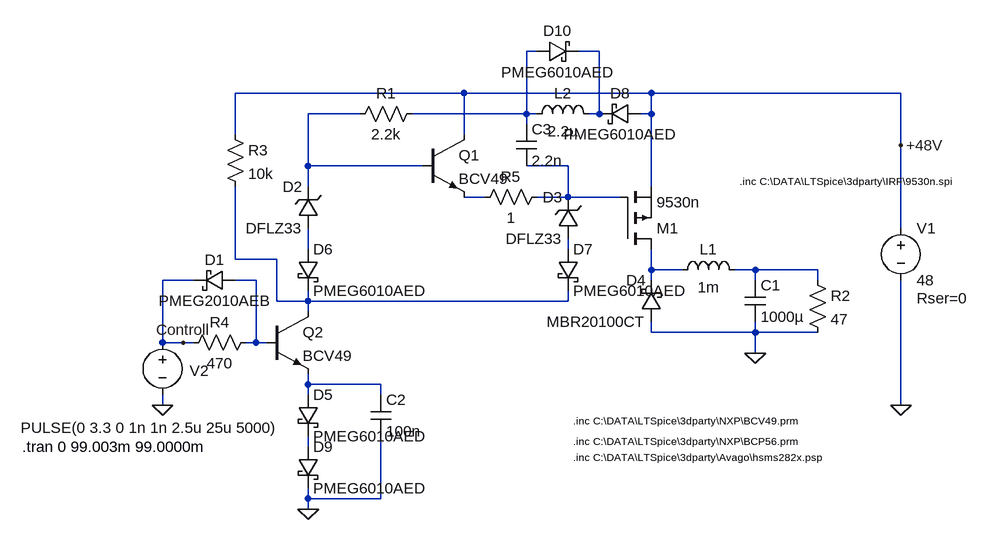
[diagram p0: schematic driver4.asc]
driver4.asc, the LTspice schematic file:
Version 4
SHEET 1 908 680
WIRE 208 -144 192 -144
WIRE 304 -144 272 -144
WIRE 96 -80 -256 -80
WIRE 384 -80 96 -80
WIRE 768 -80 384 -80
WIRE -64 -48 -144 -48
WIRE 192 -48 192 -144
WIRE 192 -48 16 -48
WIRE 208 -48 192 -48
WIRE 304 -48 304 -144
WIRE 304 -48 288 -48
WIRE 384 -48 384 -80
WIRE 384 -48 368 -48
WIRE 192 -32 192 -48
WIRE -256 -16 -256 -80
WIRE 96 -16 96 -80
WIRE 768 0 768 -80
WIRE -144 32 -144 -48
WIRE 32 32 -144 32
WIRE 256 32 192 32
WIRE -144 64 -144 32
WIRE 384 64 384 -48
WIRE 128 80 96 80
WIRE 256 80 256 32
WIRE 256 80 208 80
WIRE 336 80 256 80
WIRE 768 128 768 0
WIRE -144 160 -144 128
WIRE 256 160 256 144
WIRE -256 176 -256 64
WIRE -192 176 -256 176
WIRE 384 192 384 160
WIRE 432 192 384 192
WIRE 544 192 512 192
WIRE 640 192 544 192
WIRE -320 208 -368 208
WIRE -224 208 -256 208
WIRE 384 208 384 192
WIRE 544 208 544 192
WIRE 640 208 640 192
WIRE -192 240 -192 176
WIRE -144 240 -144 224
WIRE -144 240 -192 240
WIRE 256 240 256 224
WIRE 256 240 -144 240
WIRE -144 256 -144 240
WIRE 384 288 384 272
WIRE 544 288 544 272
WIRE 544 288 384 288
WIRE 640 288 544 288
WIRE -368 304 -368 208
WIRE -336 304 -368 304
WIRE -320 304 -336 304
WIRE -224 304 -224 208
WIRE -224 304 -240 304
WIRE -208 304 -224 304
WIRE 544 320 544 288
WIRE -144 368 -144 352
WIRE -32 368 -144 368
WIRE -144 384 -144 368
WIRE -32 384 -32 368
WIRE -368 400 -368 384
WIRE 768 400 768 208
WIRE -144 464 -144 448
WIRE -144 544 -144 528
WIRE -32 544 -32 448
WIRE -32 544 -144 544
WIRE -144 560 -144 544
FLAG -144 560 0
FLAG 768 400 0
FLAG -368 400 0
FLAG 768 0 +48V
FLAG -336 304 Controll
FLAG 544 320 0
SYMBOL pmos 336 160 M180
SYMATTR InstName M1
SYMATTR Value 9530n
SYMATTR Prefix X
SYMBOL npn 32 -16 R0
SYMATTR InstName Q1
SYMATTR Value BCV49
SYMATTR Prefix X
SYMBOL npn -208 256 R0
SYMATTR InstName Q2
SYMATTR Value BCV49
SYMATTR Prefix X
SYMBOL res 32 -64 R90
WINDOW 0 0 56 VBottom 2
WINDOW 3 32 56 VTop 2
SYMATTR InstName R1
SYMATTR Value 2.2k
SYMBOL res -224 288 R90
WINDOW 0 0 56 VBottom 2
WINDOW 3 32 56 VTop 2
SYMATTR InstName R4
SYMATTR Value 470
SYMBOL voltage 768 112 R0
WINDOW 123 0 0 Left 2
WINDOW 39 24 124 Left 2
SYMATTR SpiceLine Rser=0
SYMATTR InstName V1
SYMATTR Value 48
SYMBOL voltage -368 288 R0
WINDOW 0 42 59 Left 2
WINDOW 3 -218 147 Left 2
WINDOW 123 0 0 Left 2
WINDOW 39 0 0 Left 2
SYMATTR InstName V2
SYMATTR Value PULSE(0 3.3 0 1n 1n 2.5u 25u 5000)
SYMBOL zener -128 128 R180
WINDOW 0 24 64 Left 2
WINDOW 3 24 0 Left 2
SYMATTR InstName D2
SYMATTR Value DFLZ33
SYMBOL zener 272 144 R180
WINDOW 0 24 64 Left 2
WINDOW 3 24 0 Left 2
SYMATTR InstName D3
SYMATTR Value DFLZ33
SYMBOL schottky 400 272 R180
WINDOW 0 24 64 Left 2
WINDOW 3 24 0 Left 2
SYMATTR InstName D4
SYMATTR Value MBR20100CT
SYMATTR Description Diode
SYMATTR Type diode
SYMBOL ind 416 208 R270
WINDOW 0 32 56 VTop 2
WINDOW 3 5 56 VBottom 2
SYMATTR InstName L1
SYMATTR Value 1m
SYMATTR SpiceLine Rser=90m
SYMBOL cap 528 208 R0
SYMATTR InstName C1
SYMATTR Value 1000µ
SYMATTR SpiceLine Rser=20m
SYMBOL res 624 192 R0
SYMATTR InstName R2
SYMATTR Value 47
SYMBOL schottky -160 384 R0
SYMATTR InstName D5
SYMATTR Value PMEG6010AED
SYMATTR Description Diode
SYMATTR Type diode
SYMBOL cap -48 384 R0
SYMATTR InstName C2
SYMATTR Value 100n
SYMBOL schottky -256 192 R90
WINDOW 0 0 32 VBottom 2
WINDOW 3 32 32 VTop 2
SYMATTR InstName D1
SYMATTR Value PMEG2010AEB
SYMATTR Description Diode
SYMATTR Type diode
SYMBOL schottky -160 160 R0
SYMATTR InstName D6
SYMATTR Value PMEG6010AED
SYMATTR Description Diode
SYMATTR Type diode
SYMBOL res -272 -32 R0
SYMATTR InstName R3
SYMATTR Value 10k
SYMBOL schottky 240 160 R0
SYMATTR InstName D7
SYMATTR Value PMEG6010AED
SYMATTR Description Diode
SYMATTR Type diode
SYMBOL cap 176 -32 R0
SYMATTR InstName C3
SYMATTR Value 2.2n
SYMBOL schottky 368 -64 R90
WINDOW 0 0 32 VBottom 2
WINDOW 3 32 32 VTop 2
SYMATTR InstName D8
SYMATTR Value PMEG6010AED
SYMATTR Description Diode
SYMATTR Type diode
SYMBOL schottky -160 464 R0
SYMATTR InstName D9
SYMATTR Value PMEG6010AED
SYMATTR Description Diode
SYMATTR Type diode
SYMBOL res 224 64 R90
WINDOW 0 0 56 VBottom 2
WINDOW 3 32 56 VTop 2
SYMATTR InstName R5
SYMATTR Value 1
SYMBOL ind 192 -32 R270
WINDOW 0 32 56 VTop 2
WINDOW 3 5 56 VBottom 2
SYMATTR InstName L2
SYMATTR Value 2.2µ
SYMATTR SpiceLine Rser=1
SYMBOL schottky 208 -128 R270
WINDOW 0 32 32 VTop 2
WINDOW 3 0 32 VBottom 2
SYMATTR InstName D10
SYMATTR Value PMEG6010AED
SYMATTR Description Diode
SYMATTR Type diode
TEXT 520 56 Left 1 !.inc C:\\DATA\\LTSpice\\3dparty\\IRF\\9530n.spi
TEXT -584 464 Left 2 !.tran 0 99.003m 99.0000m
TEXT 264 456 Left 1 !.inc C:\\DATA\\LTSpice\\3dparty\\NXP\\BCP56.prm
TEXT 264 480 Left 1 !.inc C:\\DATA\\LTSpice\\3dparty\\Avago\\hsms282x.psp
TEXT 264 424 Left 1 !.inc C:\\DATA\\LTSpice\\3dparty\\NXP\\BCV49.prm

The netlist it stands for:
* driver4.asc
XM1 N009 N004 +48V 9530n  ; pins D G S
XQ1 +48V N003 N005 BCV49  ; pins C B E
XQ2 N008 N011 N012 BCV49  ; pins C B E
R1 N001 N003 2.2k
R4 N011 Controll 470
V1 +48V 0 48 Rser=0
V2 Controll 0 PULSE(0 3.3 0 1n 1n 2.5u 25u 5000)
D2 N006 N003 DFLZ33
D3 N007 N004 DFLZ33
D4 0 N009 MBR20100CT
L1 N009 N010 1m Rser=90m
C1 N010 0 1000µ Rser=20m
R2 N010 0 47
D5 N012 N013 PMEG6010AED
C2 N012 0 100n
D1 N011 Controll PMEG2010AEB
D6 N006 N008 PMEG6010AED
R3 +48V N008 10k
D7 N007 N008 PMEG6010AED
C3 N001 N004 2.2n
D8 +48V N002 PMEG6010AED
D9 N013 0 PMEG6010AED
R5 N004 N005 1
L2 N001 N002 2.2µ Rser=1
D10 N001 N002 PMEG6010AED
.model D D
.lib standard.dio
.inc C:\DATA\LTSpice\3dparty\IRF\9530n.spi
.tran 0 99.003m 99.0000m
.inc C:\DATA\LTSpice\3dparty\NXP\BCP56.prm
.inc C:\DATA\LTSpice\3dparty\Avago\hsms282x.psp
.inc C:\DATA\LTSpice\3dparty\NXP\BCV49.prm
.backanno
.end